# Altium project 22.ScreenAdapterBoard2.PrjPcb
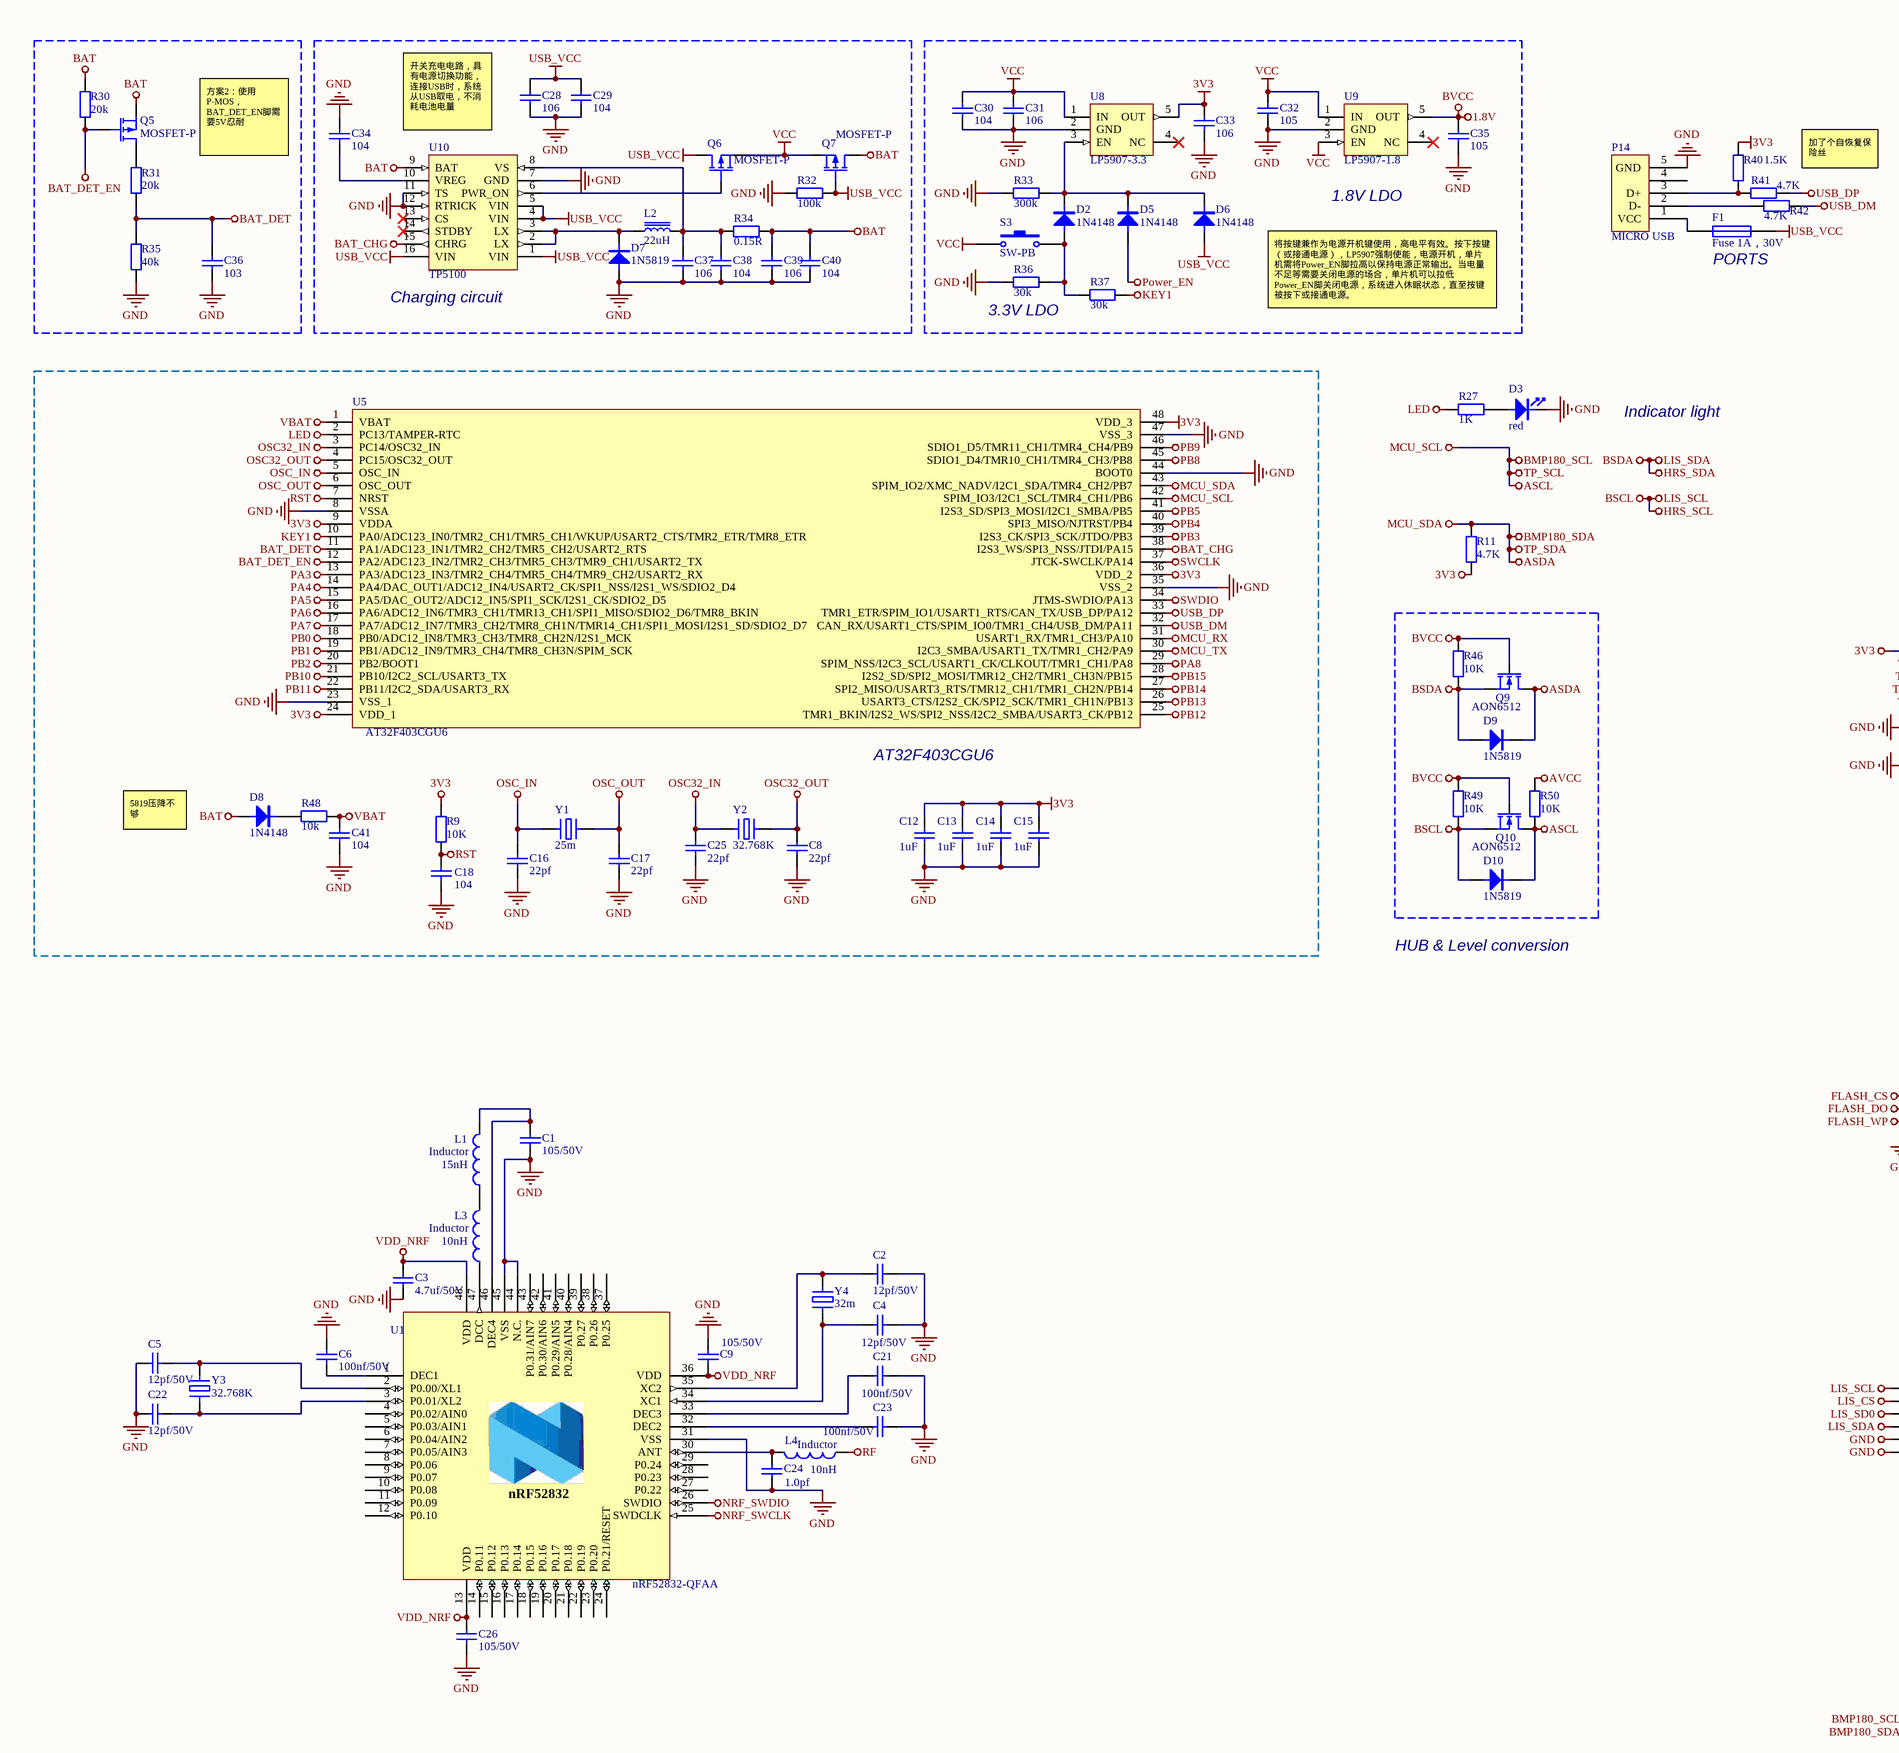
[diagram p0: WatchX2.SchDoc, left]
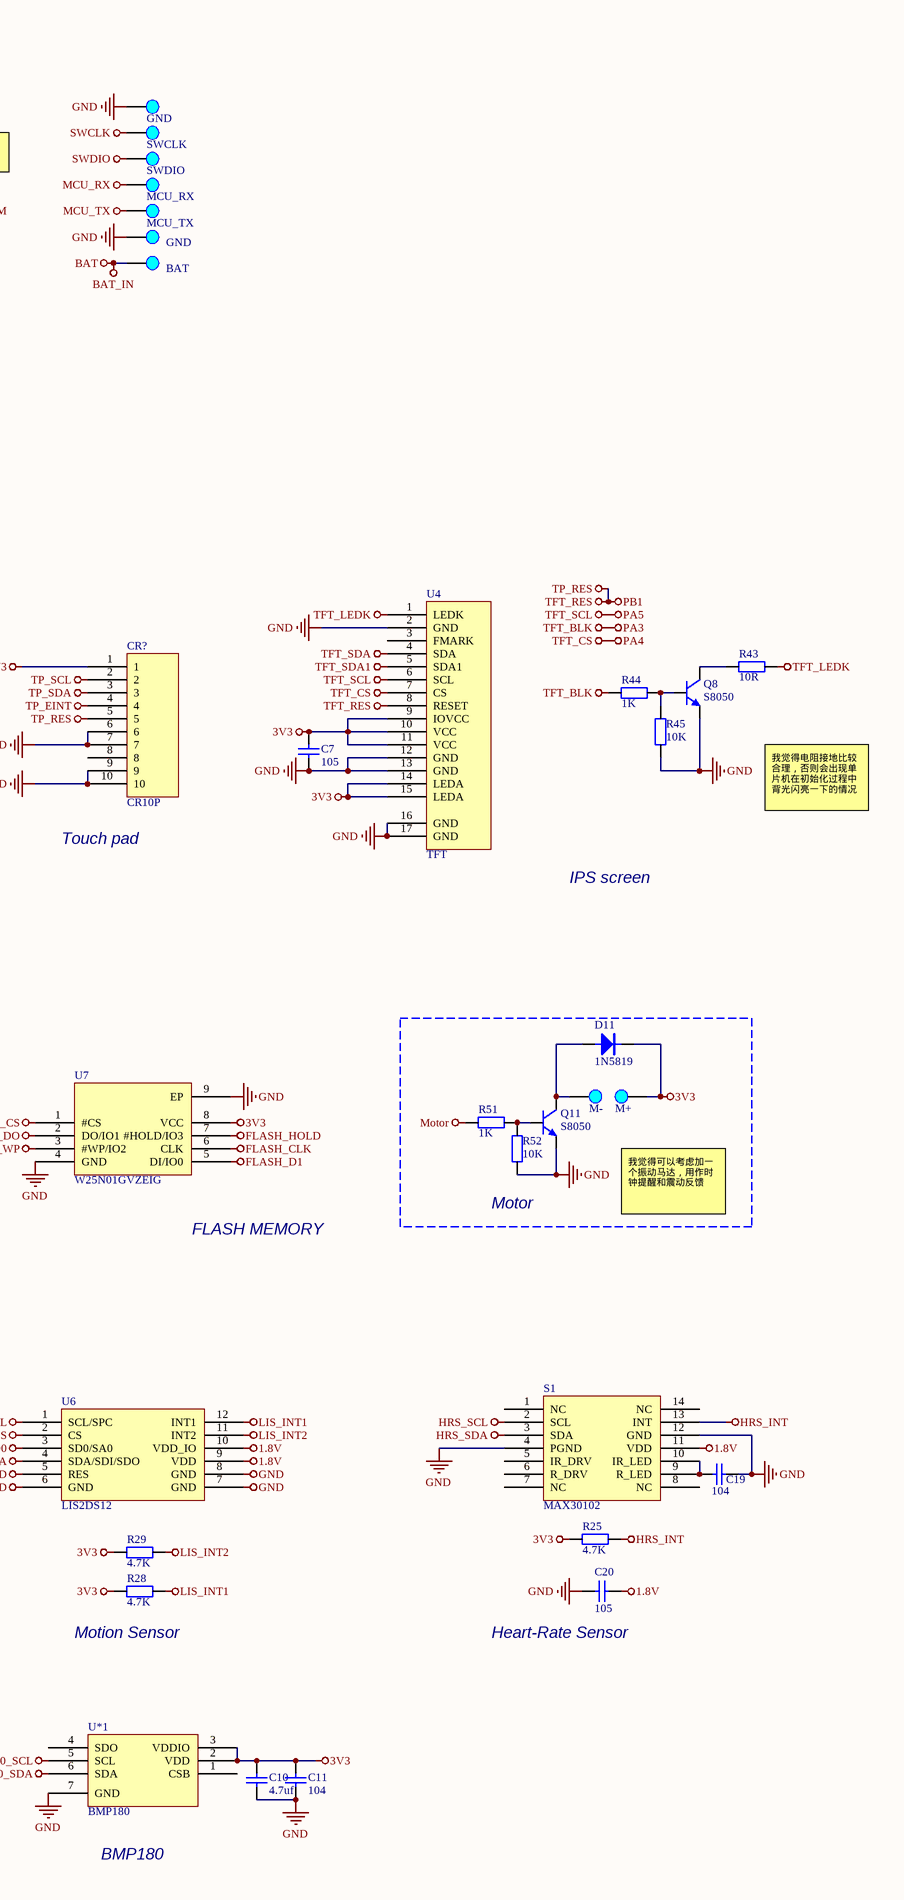
[diagram p1: WatchX2.SchDoc, right]
2 sheets, 122 parts. Net scope: global (net labels, ports and power ports of the same name join across sheets).
Board files: WatchX2.PcbDoc, ScreenAdapterBoard2.PcbDoc
Sheets:
  WatchX2.SchDoc
  ScreenAdapterBoard2.SchDoc

## Sheet WatchX2.SchDoc
size A2

### Parts
(Parts that share a designator on the sheet are numbered #1, #2 ... from top to bottom, then left to right.)
C1  _Parameter: 105/50V  [电容_C0603]  (hidden comment: 105)
C2  _Parameter: 12pf/50V  [电容_C0603]  (hidden comment: 12pf)
C3  _Parameter: 4.7uf/50V  [电容_C0603]  (hidden comment: 4.7uf)
C4  _Parameter: 12pf/50V  [电容_C0603]  (hidden comment: 12pf)
C5  _Parameter: 12pf/50V  [电容_C0603]  (hidden comment: 12pf)
C6  _Parameter: 100nf/50V  [电容_C0603]  (hidden comment: 100nf)
C7  105  [电容_C0603]
C8  22pf  [电容_C0603]
C9  _Parameter: 105/50V  [电容_C0603]  (hidden comment: 105)
C10  4.7uf  [电容_C0603]
C11  104  [电容_C0603]
C12  1uF  [电容_C0603]
C13  1uF  [电容_C0603]
C14  1uF  [电容_C0603]
C15  1uF  [电容_C0603]
C16  22pf  [电容_C0603]
C17  22pf  [电容_C0603]
C18  104  [电容_C0603]
C19  104  [电容_C0603]
C20  105  [电容_C0603]
C21  _Parameter: 100nf/50V  [电容_C0603]  (hidden comment: 100nf)
C22  _Parameter: 12pf/50V  [电容_C0603]  (hidden comment: 12pf)
C23  _Parameter: 100nf/50V  [电容_C0603]  (hidden comment: 100nf)
C24  _Parameter: 1.0pf  [电容_C0603]  (hidden comment: 100nf)
C25  22pf  [电容_C0603]
C26  _Parameter: 105/50V  [电容_C0603]  (hidden comment: 105)
C28  106  [电容_C0805]
C29  104  [电容_C0603]
C30  104  [电容_C0603]
C31  106  [电容_C0805]
C32  105  [电容_C0805]
C33  106  [电容_C0805]
C34  104  [电容_C0603]
C35  105  [电容_C0805]
C36  103  [电容_C0603]
C37  106  [电容_C0805]
C38  104  [电容_C0603]
C39  106  [电容_C0805]
C40  104  [电容_C0603]
C41  104  [电容_C0603]
CR?  CR10P  [CONN RCPT 10POS 0.4MM]
D2  1N4148  [二极管_SOD-323]
D3  red  [LED_0603]
D5  1N4148  [二极管_SOD-323]
D6  1N4148  [二极管_SOD-323]
D7  1N5819  [二极管_SOD-323]
D8  1N4148  [二极管_SOD-323]
D9  1N5819  [二极管_SOD-323]
D10  1N5819  [二极管_SOD-323]
D11  1N5819  [二极管_SOD-323]
F1  Fuse 1A，30V  [电阻_R0805]
L1#1  Inductor  value 15nH  [INDC1608L]
L2  22uH  [变压器电感_0420]
L3  Inductor  value 10nH  [INDC1608L]
L4  Inductor  value 10nH  [INDC1608L]
P14  MICRO USB  [接插件_MICRO 牛角插座 USB 卷边]
Pad1  GND  [Pad_A]
Pad2  M-  [Pad_A]
Pad3  M+  [Pad_A]
Pad4  GND  [Pad_A]
Pad5  SWCLK  [Pad_A]
Pad6  BAT  [Pad_A]
Pad7  SWDIO  [Pad_A]
Pad8  MCU_RX  [Pad_A]
Pad9  MCU_TX  [Pad_A]
Q5  MOSFET-P  [SOT23]
Q6  MOSFET-P  [SOT23]
Q7  MOSFET-P  [SOT23]
Q8#1  S8050  [三极管_SOT-23]
Q9  AON6512  [MOS_SOT-23]
Q10  AON6512  [MOS_SOT-23]
Q11  S8050  [三极管_SOT-23]
R9  10K  [电阻_R0603]
R11  4.7K  [电阻_R0603]
R25  4.7K  [电阻_R0603]
R27  1K  [电阻_R0603]
R28  4.7K  [电阻_R0603]
R29  4.7K  [电阻_R0603]
R30  20k  [电阻_R0603]
R31  20k  [电阻_R0603]
R32  100k  [电阻_R0603]
R33  300k  [电阻_R0603]
R34  0.15R  [电阻_R0603]
R35  40k  [电阻_R0603]
R36  30k  [电阻_R0603]
R37  30k  [电阻_R0603]
R40  1.5K  [电阻_R0603]
R41  4.7K  [电阻_R0603]
R42  4.7K  [电阻_R0603]
R43#1  10R  [电阻_R0603]
R44#1  1K  [电阻_R0603]
R45#1  10K  [电阻_R0603]
R46  10K  [电阻_R0603]
R48  10k  [电阻_R0603]
R49  10K  [电阻_R0603]
R50  10K  [电阻_R0603]
R51  1K  [电阻_R0603]
R52  10K  [电阻_R0603]
S1#1  MAX30102  [MAX30102]
S3  SW-PB  [KEY_8*8mm]
U1  nRF52832-QFAA  [NORDIC_QFN48]
U4  TFT  [FPC-0.30mm-15P]
U5  AT32F403CGU6  [AT主控_QFN48(6X6)]
U6  LIS2DS12  [LGA-12_L2.0-W2.0-P0.50-BL]
U7  W25N01GVZEIG  [WSON-8]
U8  LP5907-3.3  [SOT23-5]
U9  LP5907-1.8  [SOT23-5]
U10  TP5100  [QFN16-4MM]
U*1  BMP180  [LGA-7]
Y1  F: 25m  [晶振_2016]  (hidden comment: XTAL)
Y2  32.768K  [晶振_3215]
Y3  32.768K  [晶振_3215]
Y4  F: 32m  [晶振_2016]  (hidden comment: XTAL)

### Blocks framed on the sheet
Charging circuit: C28 C29 C34 C37-C40 D7 L2 Q6 Q7 R32 R34 U10
AT32F403CGU6: C8 C12-C18 C25 C41 D8 R9 R48 U5 Y1 Y2
Motor: D11 Pad2 Pad3 Q11 R51 R52

### Nets
1.8V: C20.1 C35.2 Q9.1(G) Q10.1(G) R46.1 R49.1 S1#1.11(VDD) U6.9(VDD) U6.10(VDD_IO) U9.5(OUT)  [also labelled BVCC]
3V3: C7.1 C10.2 C11.2 C12.2 C13.2 C14.2 C15.2 C33.2 CR?.1 D11.K Pad3.1 R9.2 R11.1 R25.2 R28.2 R29.2 R40.2 U4.9(IOVCC) U4.10(VCC) U4.11(VCC) U4.14(LEDA) U4.15(LEDA) U5.9(VDDA) U5.24(VDD_1) U5.36(VDD_2) U5.48(VDD_3) U7.8(VCC) U8.5(OUT) U*1.2(VDD) U*1.3(VDDIO)
ASCL: CR?.2 D10.K Q10.2(D) R50.2 U5.42(SPIM_IO3/I2C1_SCL/TMR4_CH1/PB6) U*1.5(SCL)  [also labelled BMP180_SCL, MCU_SCL, TP_SCL]
ASDA: CR?.3 D9.K Q9.2(D) R11.2 U5.43(SPIM_IO2/XMC_NADV/I2C1_SDA/TMR4_CH2/PB7) U*1.6(SDA)  [also labelled BMP180_SDA, MCU_SDA, TP_SDA]
AVCC: R50.1
BAT: C39.2 C40.1 D8.A Pad6.1 Q5.3(S) Q7.2(D) R30.2 R34.1 U10.9(BAT)  [also labelled BAT_IN]
BAT_CHG: U5.38(I2S3_WS/SPI3_NSS/JTDI/PA15) U10.15(CHRG)
BAT_DET: C36.2 R31.1 R35.2 U5.11(PA1/ADC123_IN1/TMR2_CH2/TMR5_CH2/USART2_RTS)
BAT_DET_EN: Q5.1(G) R30.1 U5.12(PA2/ADC123_IN2/TMR2_CH3/TMR5_CH3/TMR9_CH1/USART2_TX)
BSCL: D10.A Q10.3(S) R49.2 S1#1.2(SCL) U6.1(SCL/SPC)  [also labelled HRS_SCL, LIS_SCL]
BSDA: D9.A Q9.3(S) R46.2 S1#1.3(SDA) U6.4(SDA/SDI/SDO)  [also labelled HRS_SDA, LIS_SDA]
FLASH_CLK: U7.6(CLK)
FLASH_CS: U7.1(#CS)
FLASH_D1: U7.5(DI/IO0)
FLASH_DO: U7.2(DO/IO1)
FLASH_HOLD: U7.7(#HOLD/IO3)
FLASH_WP: U7.3(#WP/IO2)
GND: C1.1 C2.1 C3.1 C4.1 C5.2 C6.2 C7.2 C8.2 C9.2 C10.1 C11.1 C12.1 C13.1 C14.1 C15.1 C16.2 C17.2 C18.1 C19.1 C20.2 C21.1 C22.2 C23.1 C24.2 C25.2 C26.1 C28.1 C29.2 C30.1 C31.1 C32.1 C33.1 C34.2 C35.1 C36.1 C37.1 C38.2 C39.1 C40.2 C41.2 CR?.6 CR?.7 CR?.9 CR?.10 D3.K D7.A P14.0 P14.5(GND) Pad1.1 Pad4.1 Q8#1.3(E) Q11.3(E) R32.1 R33.2 R35.1 R36.2 R45#1.1 R52.1 S1#1.4(PGND) S1#1.12(GND) U1.0(GND) U1.31(VSS) U1.44(N.C.) U1.45(VSS) U4.2(GND) U4.12(GND) U4.13(GND) U4.16(GND) U4.17(GND) U5.0(VSS) U5.8(VSSA) U5.23(VSS_1) U5.35(VSS_2) U5.44(BOOT0) U5.47(VSS_3) U6.5(RES) U6.6(GND) U6.7(GND) U6.8(GND) U7.4(GND) U7.9(EP) U8.2(GND) U9.2(GND) U10.7(GND) U10.11(TS) U10.12(RTRICK) U*1.7(GND)
HRS_INT: R25.1 S1#1.13(INT)
KEY1: R37.1 U5.10(PA0/ADC123_IN0/TMR2_CH1/TMR5_CH1/WKUP/USART2_CTS/TMR2_ETR/TMR8_ETR)
LED: R27.1 U5.2(PC13/TAMPER-RTC)
LIS_CS: U6.2(CS)
LIS_INT1: R28.1 U6.12(INT1)
LIS_INT2: R29.1 U6.11(INT2)
LIS_SD0: U6.3(SD0/SA0)
MCU_RX: Pad8.1 U5.31(USART1_RX/TMR1_CH3/PA10)
MCU_TX: Pad9.1 U5.30(I2C3_SMBA/USART1_TX/TMR1_CH2/PA9)
Motor: R51.1
NRF_SWCLK: U1.25(SWDCLK)
NRF_SWDIO: U1.26(SWDIO)
OSC32_IN: C25.1 U5.3(PC14/OSC32_IN) Y2.1
OSC32_OUT: C8.1 U5.4(PC15/OSC32_OUT) Y2.2
OSC_IN: C16.1 U5.5(OSC_IN) Y1.1
OSC_OUT: C17.1 U5.6(OSC_OUT) Y1.2
PA3: R44#1.1 U5.13(PA3/ADC123_IN3/TMR2_CH4/TMR5_CH4/TMR9_CH2/USART2_RX)  [also labelled TFT_BLK]
PA4: U4.7(CS) U5.14(PA4/DAC_OUT1/ADC12_IN4/USART2_CK/SPI1_NSS/I2S1_WS/SDIO2_D4)  [also labelled TFT_CS]
PA5: U4.6(SCL) U5.15(PA5/DAC_OUT2/ADC12_IN5/SPI1_SCK/I2S1_CK/SDIO2_D5)  [also labelled TFT_SCL]
PA6: U5.16(PA6/ADC12_IN6/TMR3_CH1/TMR13_CH1/SPI1_MISO/SDIO2_D6/TMR8_BKIN)
PA7: U5.17(PA7/ADC12_IN7/TMR3_CH2/TMR8_CH1N/TMR14_CH1/SPI1_MOSI/I2S1_SD/SDIO2_D7)
PA8: U5.29(SPIM_NSS/I2C3_SCL/USART1_CK/CLKOUT/TMR1_CH1/PA8)
PB0: U5.18(PB0/ADC12_IN8/TMR3_CH3/TMR8_CH2N/I2S1_MCK)
PB1: CR?.5 U4.8(RESET) U5.19(PB1/ADC12_IN9/TMR3_CH4/TMR8_CH3N/SPIM_SCK)  [also labelled TFT_RES, TP_RES]
PB2: U5.20(PB2/BOOT1)
PB3: U5.39(I2S3_CK/SPI3_SCK/JTDO/PB3)
PB4: U5.40(SPI3_MISO/NJTRST/PB4)
PB5: U5.41(I2S3_SD/SPI3_MOSI/I2C1_SMBA/PB5)
PB8: U5.45(SDIO1_D4/TMR10_CH1/TMR4_CH3/PB8)
PB9: U5.46(SDIO1_D5/TMR11_CH1/TMR4_CH4/PB9)
PB10: U5.21(PB10/I2C2_SCL/USART3_TX)
PB11: U5.22(PB11/I2C2_SDA/USART3_RX)
PB12: U5.25(TMR1_BKIN/I2S2_WS/SPI2_NSS/I2C2_SMBA/USART3_CK/PB12)
PB13: U5.26(USART3_CTS/I2S2_CK/SPI2_SCK/TMR1_CH1N/PB13)
PB14: U5.27(SPI2_MISO/USART3_RTS/TMR12_CH1/TMR1_CH2N/PB14)
PB15: U5.28(I2S2_SD/SPI2_MOSI/TMR12_CH2/TMR1_CH3N/PB15)
Power_EN: D5.A
RF: L4.1
RST: C18.2 R9.1 U5.7(NRST)
SWCLK: Pad5.1 U5.37(JTCK-SWCLK/PA14)
SWDIO: Pad7.1 U5.34(JTMS-SWDIO/PA13)
TFT_LEDK: R43#1.2 U4.1(LEDK)
TFT_SDA: U4.4(SDA)
TFT_SDA1: U4.5(SDA1)
TP_EINT: CR?.4
USB_DM: R42.2 U5.32(CAN_RX/USART1_CTS/SPIM_IO0/TMR1_CH4/USB_DM/PA11)
USB_DP: R41.2 U5.33(TMR1_ETR/SPIM_IO1/USART1_RTS/CAN_TX/USB_DP/PA12)
USB_VCC: C28.2 C29.1 D6.A F1.2 Q6.2(D) Q7.1(G) R32.2 U10.1(VIN) U10.4(VIN) U10.5(VIN) U10.16(VIN)
VBAT: C41.1 R48.1 U5.1(VBAT)
VCC: C30.2 C31.2 C32.2 Q6.3(S) Q7.3(S) S3.1 U8.1(IN) U9.1(IN) U9.3(EN)
VDD_NRF: C3.2 C9.1 C26.2 U1.13(VDD) U1.36(VDD) U1.48(VDD)
NetC1_2: C1.2 L1#1.2 U1.46(DEC4)
NetC2_2: C2.2 U1.35(XC2) Y4.2
NetC4_2: C4.2 U1.34(XC1) Y4.1
NetC5_1: C5.1 U1.2(P0.00/XL1) Y3.2
NetC6_1: C6.1 U1.1(DEC1)
NetC19_2: C19.2 S1#1.9(R_LED) S1#1.10(IR_LED)
NetC21_2: C21.2 U1.33(DEC3)
NetC22_1: C22.1 U1.3(P0.01/XL2) Y3.1
NetC23_2: C23.2 U1.32(DEC2)
NetC24_1: C24.1 L4.2 U1.30(ANT)
NetC34_1: C34.1 U10.10(VREG)
NetC37_2: C37.2 C38.1 L2.2 R34.2 U10.8(VS)
NetD2_A: D2.A R36.1 R37.2 S3.2
NetD2_K: D2.K D5.K D6.K R33.1 U8.3(EN)
NetD3_A: D3.A R27.2
NetD7_K: D7.K L2.1 U10.2(LX) U10.3(LX)
NetD8_K: D8.K R48.2
NetD11_A: D11.A Pad2.1 Q11.2(C)
NetF1_1: F1.1 P14.1(VCC)
NetL1#1_1: L1#1.1 L3.2
NetL3_1: L3.1 U1.47(DCC)
NetP14_2: P14.2(D-) R42.1
NetP14_3: P14.3(D+) R40.1 R41.1
NetQ5_2: Q5.2(D) R31.2
NetQ6_1: Q6.1(G) U10.6(PWR_ON)
NetQ8#1_1: Q8#1.1(B) R44#1.2 R45#1.2
NetQ8#1_2: Q8#1.2(C) R43#1.1
NetQ11_1: Q11.1(B) R51.2 R52.2

Not connected (* = marked no-connect by the designer): CR? 8; P14 4; S1#1 1(NC) 5(IR_DRV) 6(R_DRV) 7(NC) 8(NC) 14(NC); U1 4(P0.02/AIN0) 5(P0.03/AIN1) 6(P0.04/AIN2) 7(P0.05/AIN3) 8(P0.06) 9(P0.07) 10(P0.08) 11(P0.09) 12(P0.10) 14(P0.11) 15(P0.12) 16(P0.13) 17(P0.14) 18(P0.15) 19(P0.16) 20(P0.17) 21(P0.18) 22(P0.19) 23(P0.20) 24(P0.21/RESET) 27(P0.22) 28(P0.23) 29(P0.24) 37(P0.25) 38(P0.26) 39(P0.27) 40(P0.28/AIN4) 41(P0.29/AIN5) 42(P0.30/AIN6) 43(P0.31/AIN7); U4 3(FMARK); U8 4(NC)*; U9 4(NC)*; U10 13(CS)* 14(STDBY)*; U*1 1(CSB) 4(SDO)

### Notes on the sheet
- 方案2：使用P-MOS，BAT_DET_EN脚需要5V忍耐
- 开关充电电路，具有电源切换功能，连接USB时，系统从USB取电，不消耗电池电量
- (near U9) 1.8V LDO
- 加了个自恢复保险丝
- (near F1) PORTS
- (near R36) 3.3V LDO
- 将按键兼作为电源开机键使用，高电平有效。按下按键（或接通电源），LP5907强制使能，电源开机，单片机需将Power_EN脚拉高以保持电源正常输出。当电量不足等需要关闭电源的场合，单片机可以拉低Power_EN脚关闭电源，系统进入休眠状态，直至按键被按下或接通电源。
- Indicator light
- 我觉得电阻接地比较合理，否则会出现单片机在初始化过程中背光闪亮一下的情况
- 5819压降不够
- (near CR?) Touch pad
- IPS screen
- HUB & Level conversion
- 场效应管应并联肖特基二极管，否则低电平电压不够低。
- FLASH MEMORY
- 我觉得可以考虑加一个振动马达，用作时钟提醒和震动反馈
- (near R28) Motion Sensor
- (near C20) Heart-Rate Sensor
- BMP180
- (in symbol nRF52832-QFAA) nRF52832

### Library data of the parts
C1 C9 C26 = Cap: _Material: X7R; _Voltage: 50V; _Slash: /; _Specification: Cap,0805,X7R,105,50V,10%; _Comma: ,; _Accuracy: 10%; _Footprint: 0805; _Capacitance: 105; _Name: Cap
C2 C4 C5 C22 = Cap: _Material: X7R; _Voltage: 50V; _Slash: /; _Specification: Cap,0805,X7R,12pf,50V,10%; _Comma: ,; _Accuracy: 10%; _Footprint: 0805; _Capacitance: 12pf; _Name: Cap
C3 = Cap: _Material: X7R; _Voltage: 50V; _Slash: /; _Specification: Cap,0805,X7R,4.7uf,50V,10%; _Comma: ,; _Accuracy: 10%; _Footprint: 0805; _Capacitance: 4.7uf; _Name: Cap
C6 C21 C23 C24 = Cap: _Material: X7R; _Voltage: 50V; _Slash: /; _Specification: Cap,0805,X7R,100nf,50V,10%; _Comma: ,; _Accuracy: 10%; _Footprint: 0805; _Capacitance: 100nf; _Name: Cap
C7 C8 C10-C20 C25 C28-C41 = cap: U: 50V; 参数: Cap,0805,X7R,104K,50V,125C,±10%
  C7 C20 C32 C35: C: 105
  C8 C16 C17 C25: C: 22pf
  C10: C: 4.7uf
  C11 C18 C19 C29 C30 C34 C38 C40 C41: C: 104
  C12-C15: C: 1uF
  C28 C31 C33 C37 C39: C: 106
  C36: C: 103
CR? = CONN RCPT 10P: 板对板连接器
D2 D5 D6 D8 = Diode: _Specification: Diode,1N4148,SOD-323,1A,40V; _Comma: ,; _Footprint: SOD-323; _Voltage: 40V; _Current: 1A; _Name: Diode; _Model: 1N4148
D3 = LED: 参数: LED,0603,Red
D7 D9-D11 = Diode: _Specification: Diode,1N5819,SOD-323,1A,40V; _Comma: ,; _Footprint: SOD-323; _Voltage: 40V; _Current: 1A; _Name: Diode; _Model: 1N5819
F1 = Fuse 1: Fuse; Published: 8-Jun-2000; LatestRevisionDate: 17-Jul-2002; LatestRevisionNote: Re-released for DXP Platform.; PackageReference: PIN-W2/E2.8; Publisher: Altium Limited; PackageDescription: Thru-Hole; 2 Leads
L1#1 L3 L4 = Inductor: Code_IEC: 1005; Published: 8-Jun-2000; LatestRevisionDate: 29-May-2009; LatestRevisionNote: IPC-7351 Footprint Added.; PackageReference: 0402-A; Publisher: Altium Limited; PackageDescription: Chip Inductor; Code_JEITA: 0402
L2 = Inductor Iron 2: _Current: 10A; _Accuracy: 20%; _Footprint: 1040; _Name: IND; _Specification: IND,1040,22uH,10A,20%; _Comma: ,; _Value: 22uH
P14 = MICRO USB 5PIN: _Comma: ,; _Name: Port; _Specification: Port,MICRO USB,5PIN; _Value: 5PIN; _Model: MICRO USB
Pad1 Pad4 = Pad: _Funcyusa: Test; _Specification: Pad,Test,GND; _Comma: ,; _Name: Pad; _Remarks: GND
Pad2 = Pad: _Funcyusa: Test; _Specification: Pad,Test,M-; _Comma: ,; _Name: Pad; _Remarks: M-
Pad3 = Pad: _Funcyusa: Test; _Specification: Pad,Test,M+; _Comma: ,; _Name: Pad; _Remarks: M+
Pad5 = Pad: _Funcyusa: Test; _Specification: Pad,Test,SWCLK; _Comma: ,; _Name: Pad; _Remarks: SWCLK
Pad6 = Pad: _Funcyusa: Test; _Specification: Pad,Test,BAT; _Comma: ,; _Name: Pad; _Remarks: BAT
Pad7 = Pad: _Funcyusa: Test; _Specification: Pad,Test,SWDIO; _Comma: ,; _Name: Pad; _Remarks: SWDIO
Pad8 = Pad: _Funcyusa: Test; _Specification: Pad,Test,MCU_RX; _Comma: ,; _Name: Pad; _Remarks: MCU_RX
Pad9 = Pad: _Funcyusa: Test; _Specification: Pad,Test,MCU_TX; _Comma: ,; _Name: Pad; _Remarks: MCU_TX
Q5-Q7 = MOSFET-P: P-Channel MOSFET; Published: 8-Jun-2000; LatestRevisionDate: 17-Jul-2002; LatestRevisionNote: Re-released for DXP Platform.; PackageVersion: 1995/1996; PackageReference: E3; Publisher: Altium Limited; PackageDescription: TO, Flat Index; 3 In-Line, Axial Leads; Body Dia. 4.6mm; Lead Dia. 0.5 mm (max)
Q8#1 Q11 = Triode-NPN: _Comma: ,; _Current: 500mA; _Footprint: SOT-23; _Name: Triode; _Specification: Triode,NPN,S8050,SOT-23,500mA,40V; _Voltage: 40V; _Polarity: NPN; _Model: S8050
Q9 Q10 = MOSFET-N: _Comma: ,; _Current: 150A; _Footprint: DFN5*6; _Name: N-MOSFET; _Specification: N-MOSFET,AON6512,DFN5*6,150A,30V; _Voltage: 30V; _Model: AON6512
R9 R11 R25 R27-R37 R40-R42 R46 R48-R50 = Res: P: 1/8W; 参数: Res,0805,0R,±1%,1/8W,100ppm,155C
  R9 R46 R49 R50: R: 10K
  R11 R25 R28 R29 R41 R42: R: 4.7K
  R27: R: 1K
  R30 R31: R: 20k
  R32: R: 100k
  R33: R: 300k
  R34: R: 0.15R
  R35: R: 40k
  R36 R37: R: 30k
  R40: R: 1.5K
  R48: R: 10k
R43#1 = Res: _Accuracy: 1%; _Power: 1/8W; _Footprint: 0805; _Drift: 100ppm; _Comma: ,; _Specification: Res,0805,10R,1%,1/8W,100ppm; _Name: Res; _Value: 10R
R44#1 R51 = Res: _Accuracy: 1%; _Power: 1/8W; _Footprint: 0805; _Drift: 100ppm; _Comma: ,; _Specification: Res,0805,1K,1%,1/8W,100ppm; _Name: Res; _Value: 1K
R45#1 R52 = Res: _Accuracy: 1%; _Power: 1/8W; _Footprint: 0805; _Drift: 100ppm; _Comma: ,; _Specification: Res,0805,10K,1%,1/8W,100ppm; _Name: Res; _Value: 10K
S1#1 = MAX30102: 血氧浓度传感器
S3 = SW-PB: 按键
U1 = nRF52832-QFAA: QFN48; _Comma: ,; _Name: MCU; _Specification: MCU,nRF52832-QFAA,QFN48; _Footprint: QFN48; _Model: nRF52832-QFAA
U4 = TFT_IPS1-1.54寸240*240-AML015410V1: IPS电容式触摸屏
U5 = AT32F403CGU6: _Footprint: QFN48; _Comma: ,; _Name: MCU; _Specification: MCU,AT32F403CGU6,QFN48; _Model: AT32F403CGU6
U6 = LIS2DS12: 运动传感器
U7 = W25N01GVZEIG: 华邦flash 1GBit
U8 U9 = LP5907: LDO
U10 = TP5100: 2A 4.2V\8.4V开关锂电池充电器
U*1 = BMP180: 数字气压传感器
Y2 Y3 = XTAL_A: _Name: CRYSTALS; _Comma: ,; _Specification: CRYSTALS,32.768K,*,10ppm,12pF; _Accuracy: 10ppm; _CL: 12pF; _Footprint: *; _Frequency: 32.768K

## Sheet ScreenAdapterBoard2.SchDoc
size A4
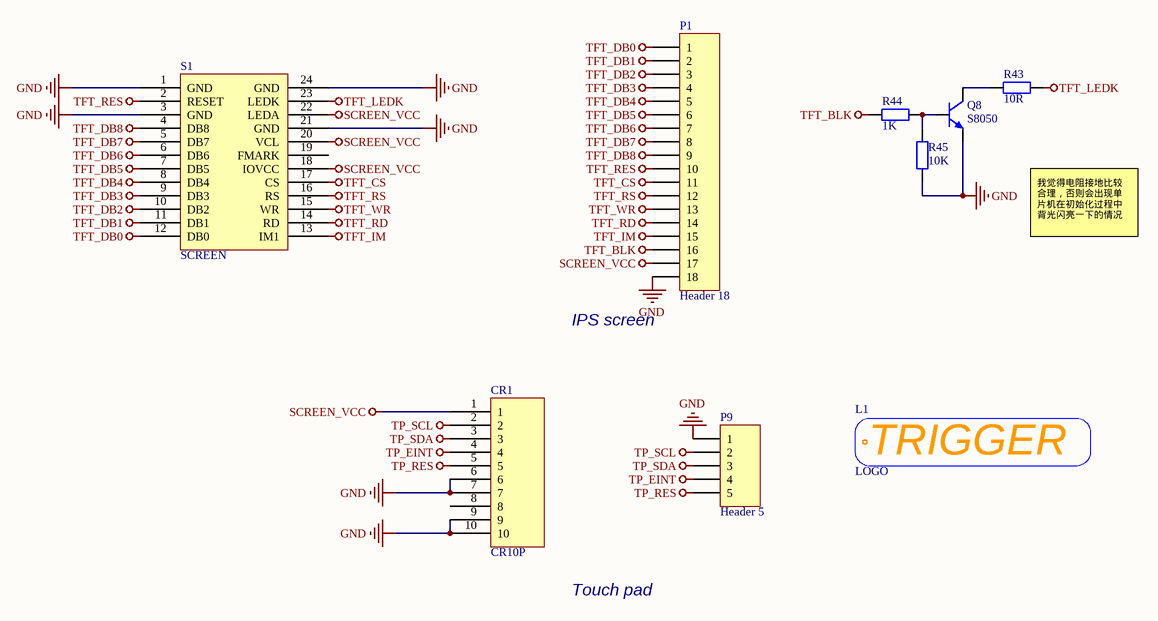
[diagram p2: ScreenAdapterBoard2.SchDoc]

### Parts
(Parts that share a designator on the sheet are numbered #1, #2 ... from top to bottom, then left to right.)
CR1  CR10P  [CONN RCPT 10POS 0.4MM]
L1#2  LOGO  [LOGO L BS]
P1  Header 18  [HDR1X18]
P9  Header 5  [HDR1X5]
Q8#2  S8050  [三极管_SOT-23]
R43#2  10R  [电阻_R0603]
R44#2  1K  [电阻_R0603]
R45#2  10K  [电阻_R0603]
S1#2  SCREEN  [CONN-SMD_DF37NC-24DS-0.4V(51)]

### Nets
GND: CR1.6 CR1.7 CR1.9 CR1.10 P1.18 P9.1 Q8#2.3(E) R45#2.1 S1#2.1(GND) S1#2.3(GND) S1#2.21(GND) S1#2.24(GND)
SCREEN_VCC: CR1.1 P1.17 S1#2.18(IOVCC) S1#2.20(VCL) S1#2.22(LEDA)
TFT_BLK: P1.16 R44#2.1  [project net PA3]
TFT_CS: P1.11 S1#2.17(CS)  [project net PA4]
TFT_DB0: P1.1 S1#2.12(DB0)
TFT_DB1: P1.2 S1#2.11(DB1)
TFT_DB2: P1.3 S1#2.10(DB2)
TFT_DB3: P1.4 S1#2.9(DB3)
TFT_DB4: P1.5 S1#2.8(DB4)
TFT_DB5: P1.6 S1#2.7(DB5)
TFT_DB6: P1.7 S1#2.6(DB6)
TFT_DB7: P1.8 S1#2.5(DB7)
TFT_DB8: P1.9 S1#2.4(DB8)
TFT_IM: P1.15 S1#2.13(IM1)
TFT_LEDK: R43#2.2 S1#2.23(LEDK)
TFT_RD: P1.14 S1#2.14(RD)
TFT_RES: CR1.5 P1.10 P9.5 S1#2.2(RESET)  [also labelled TP_RES]  [project net PB1]
TFT_RS: P1.12 S1#2.16(RS)
TFT_WR: P1.13 S1#2.15(WR)
TP_EINT: CR1.4 P9.4
TP_SCL: CR1.2 P9.2  [project net ASCL]
TP_SDA: CR1.3 P9.3  [project net ASDA]
NetQ8#2_1: Q8#2.1(B) R44#2.2 R45#2.2
NetQ8#2_2: Q8#2.2(C) R43#2.1

Not connected (* = marked no-connect by the designer): CR1 8; S1#2 19(FMARK)

### Notes on the sheet
- 我觉得电阻接地比较合理，否则会出现单片机在初始化过程中背光闪亮一下的情况
- (near P1) IPS screen
- Touch pad
- (in symbol LOGO_TRIGGER) TRIGGER

### Library data of the parts
CR1 = CONN RCPT 10P: 板对板连接器
L1#2 = LOGO_TRIGGER
P1 = Header 18: Header, 18-Pin; LatestRevisionDate: 17-Jul-2002; LatestRevisionNote: Re-released for DXP Platform.; Publisher: Altium Limited
P9 = Header 5: Header, 5-Pin; LatestRevisionDate: 17-Jul-2002; LatestRevisionNote: Re-released for DXP Platform.; Publisher: Altium Limited
Q8#2 = Triode-NPN: as Q8#1 on sheet WatchX2; _Model: S8050
R43#2 = Res: as R43#1 on sheet WatchX2; _Name: Res; _Value: 10R
R44#2 = Res: as R44#1 on sheet WatchX2; _Name: Res; _Value: 1K
R45#2 = Res: as R45#1 on sheet WatchX2; _Name: Res; _Value: 10K
S1#2 = SCREEN 1.54  24P

## Nets that join several sheets
ASCL: WatchX2 (6 pins), ScreenAdapterBoard2 (CR1.2 P9.2)
ASDA: WatchX2 (6 pins), ScreenAdapterBoard2 (CR1.3 P9.3)
GND: WatchX2 (87 pins), ScreenAdapterBoard2 (12 pins)
PA3: WatchX2 (R44#1.1 U5.13), ScreenAdapterBoard2 (P1.16 R44#2.1)
PA4: WatchX2 (U4.7 U5.14), ScreenAdapterBoard2 (P1.11 S1#2.17)
PB1: WatchX2 (CR?.5 U4.8 U5.19), ScreenAdapterBoard2 (CR1.5 P1.10 P9.5 S1#2.2)
TFT_LEDK: WatchX2 (R43#1.2 U4.1), ScreenAdapterBoard2 (R43#2.2 S1#2.23)
TP_EINT: WatchX2 (CR?.4), ScreenAdapterBoard2 (CR1.4 P9.4)